# Altium schematic sheet P06_Boot.SchDoc
size A
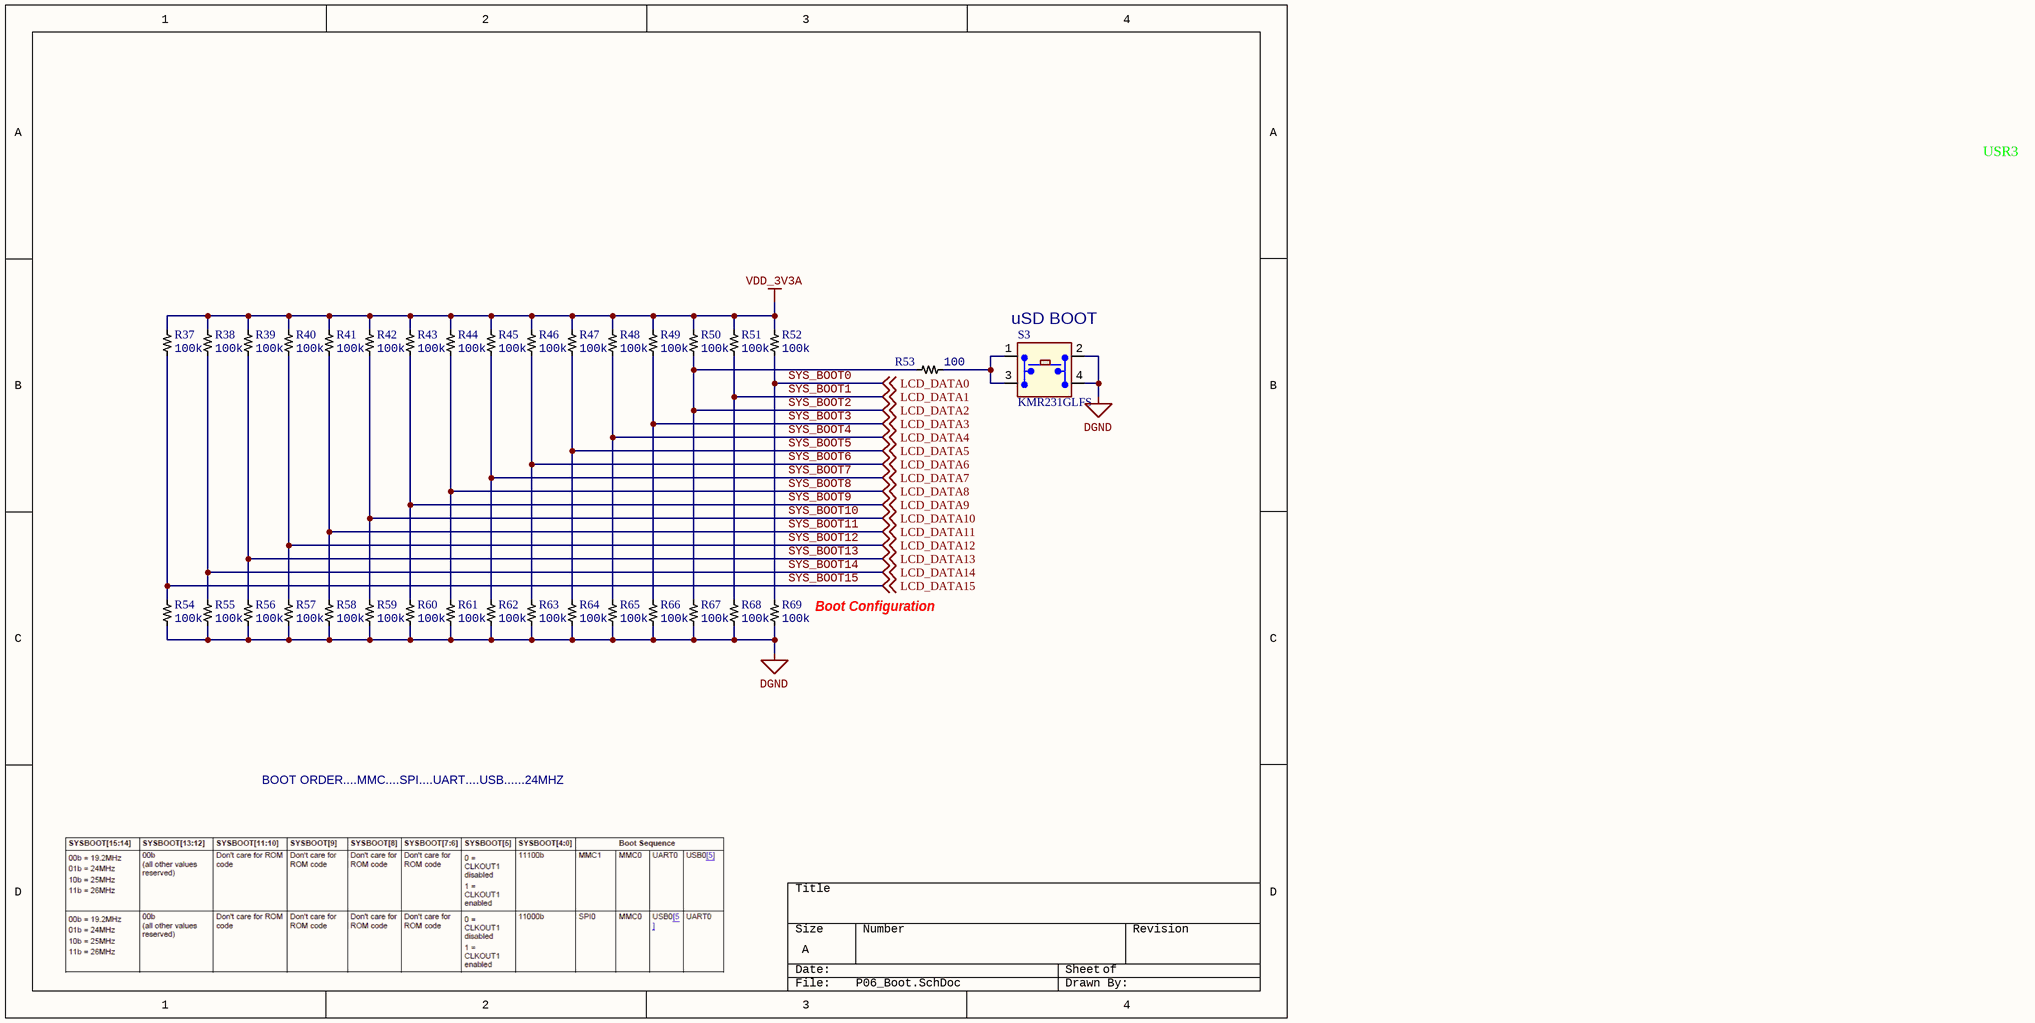
[diagram p0: P06_Boot.SchDoc]

## Parts
R37  Resistance: 100k  [RES0402]  (hidden comment: RC0402FR-07100KL)
R38  Resistance: 100k  [RES0402]  (hidden comment: RC0402FR-07100KL)
R39  Resistance: 100k  [RES0402]  (hidden comment: RC0402FR-07100KL)
R40  Resistance: 100k  [RES0402]  (hidden comment: RC0402FR-07100KL)
R41  Resistance: 100k  [RES0402]  (hidden comment: RC0402FR-07100KL)
R42  Resistance: 100k  [RES0402]  (hidden comment: RC0402FR-07100KL)
R43  Resistance: 100k  [RES0402]  (hidden comment: RC0402FR-07100KL)
R44  Resistance: 100k  [RES0402]  (hidden comment: RC0402FR-07100KL)
R45  Resistance: 100k  [RES0402]  (hidden comment: RC0402FR-07100KL)
R46  Resistance: 100k  [RES0402]  (hidden comment: RC0402FR-07100KL)
R47  Resistance: 100k  [RES0402]  (hidden comment: RC0402FR-07100KL)
R48  Resistance: 100k  [RES0402]  (hidden comment: RC0402FR-07100KL)
R49  Resistance: 100k  [RES0402]  (hidden comment: RC0402FR-07100KL)
R50  Resistance: 100k  [RES0402]  (hidden comment: RC0402FR-07100KL)
R51  Resistance: 100k  [RES0402]  (hidden comment: RC0402FR-07100KL)
R52  Resistance: 100k  [RES0402]  (hidden comment: RC0402FR-07100KL)
R53  Resistance: 100  [RES0402]  (hidden comment: RC0402FR-07100RL)
R54  Resistance: 100k  [RES0402]  (hidden comment: RC0402FR-07100KL)
R55  Resistance: 100k  [RES0402]  (hidden comment: RC0402FR-07100KL)
R56  Resistance: 100k  [RES0402]  (hidden comment: RC0402FR-07100KL)
R57  Resistance: 100k  [RES0402]  (hidden comment: RC0402FR-07100KL)
R58  Resistance: 100k  [RES0402]  (hidden comment: RC0402FR-07100KL)
R59  Resistance: 100k  [RES0402]  (hidden comment: RC0402FR-07100KL)
R60  Resistance: 100k  [RES0402]  (hidden comment: RC0402FR-07100KL)
R61  Resistance: 100k  [RES0402]  (hidden comment: RC0402FR-07100KL)
R62  Resistance: 100k  [RES0402]  (hidden comment: RC0402FR-07100KL)
R63  Resistance: 100k  [RES0402]  (hidden comment: RC0402FR-07100KL)
R64  Resistance: 100k  [RES0402]  (hidden comment: RC0402FR-07100KL)
R65  Resistance: 100k  [RES0402]  (hidden comment: RC0402FR-07100KL)
R66  Resistance: 100k  [RES0402]  (hidden comment: RC0402FR-07100KL)
R67  Resistance: 100k  [RES0402]  (hidden comment: RC0402FR-07100KL)
R68  Resistance: 100k  [RES0402]  (hidden comment: RC0402FR-07100KL)
R69  Resistance: 100k  [RES0402]  (hidden comment: RC0402FR-07100KL)
S3  KMR231GLFS  [SW4SMD_63X161LS]

## Nets
DGND: R54.1 R55.1 R56.1 R57.1 R58.1 R59.1 R60.1 R61.1 R62.1 R63.1 R64.1 R65.1 R66.1 R67.1 R68.1 R69.1 S3.2(A2) S3.4
VDD_3V3A: R37.2 R38.2 R39.2 R40.2 R41.2 R42.2 R43.2 R44.2 R45.2 R46.2 R47.2 R48.2 R49.2 R50.2 R51.2 R52.2
SYS_BOOT0: R52.1 R69.2 ; off-sheet LCD_DATA0  [also labelled LCD_DATA0]
SYS_BOOT1: R51.1 R68.2 ; off-sheet LCD_DATA1  [also labelled LCD_DATA1]
SYS_BOOT2: R50.1 R53.1 R67.2 ; off-sheet LCD_DATA2  [also labelled LCD_DATA2]
SYS_BOOT3: R49.1 R66.2 ; off-sheet LCD_DATA3  [also labelled LCD_DATA3]
SYS_BOOT4: R48.1 R65.2 ; off-sheet LCD_DATA4  [also labelled LCD_DATA4]
SYS_BOOT5: R47.1 R64.2 ; off-sheet LCD_DATA5  [also labelled LCD_DATA5]
SYS_BOOT6: R46.1 R63.2 ; off-sheet LCD_DATA6  [also labelled LCD_DATA6]
SYS_BOOT7: R45.1 R62.2 ; off-sheet LCD_DATA7  [also labelled LCD_DATA7]
SYS_BOOT8: R44.1 R61.2 ; off-sheet LCD_DATA8  [also labelled LCD_DATA8]
SYS_BOOT9: R43.1 R60.2 ; off-sheet LCD_DATA9  [also labelled LCD_DATA9]
SYS_BOOT10: R42.1 R59.2 ; off-sheet LCD_DATA10  [also labelled LCD_DATA10]
SYS_BOOT11: R41.1 R58.2 ; off-sheet LCD_DATA11  [also labelled LCD_DATA11]
SYS_BOOT12: R40.1 R57.2 ; off-sheet LCD_DATA12  [also labelled LCD_DATA12]
SYS_BOOT13: R39.1 R56.2 ; off-sheet LCD_DATA13  [also labelled LCD_DATA13]
SYS_BOOT14: R38.1 R55.2 ; off-sheet LCD_DATA14  [also labelled LCD_DATA14]
SYS_BOOT15: R37.1 R54.2 ; off-sheet LCD_DATA15  [also labelled LCD_DATA15]
NetR53_2: R53.2 S3.1(A1) S3.3(A3)

## Notes on the sheet
- USR3
- (near S3) uSD BOOT
- (near R69) Boot Configuration
- BOOT ORDER....MMC....SPI....UART....USB......24MHZ

## Library data of the parts
R37-R52 R54-R69 = RES_100k: Resistor 100kOhm 0402 SMD; Manufacturer: Yageo; Temperature Coefficient: 100ppm/°C; Tolerance: 1%; Power Rating: 63mW; Voltage Rating: 50V; Composition: Thick Film; Features: Moisture Resistant; Height: 0.016inch; Manufacturer Part Number: RC0402FR-07100KL; Number of Terminations: 2; Packaging: Tape and Reel; RoHS: Yes; Supplier 1: Mouser; Supplier Part Number 1: 603-RC0402FR-07100KL; Case/Package: 0402; Case Code (Metric): 1005; Case Code (Imperial): 0402; Min Operating Temperature: -55°C; Max Operating Temperature: 155°C; Package Quantity: 1; Termination: SMD/SMT; Military Standard: Not; Max Power Dissipation: 63mW; Working Voltage: 50V; Length: 0.039inch; Width: 0.02inch; Depth: 0.5mm; REACH SVHC: No SVHC; Lead Free: Lead Free; ComponentLink2Description: Datasheet; ComponentLink2URL: https://www.yageo.com/upload/media/product/productsearch/datasheet/rchip/PYu-RC_Group_51_RoHS_L_10.pdf; Supplier 2: Digi-Key; Supplier Part Number 2: 311-100KLRCT-ND
R53 = RES_100: Resistor 100Ohm 0402 SMD; Manufacturer: Yageo; Temperature Coefficient: 100ppm/°C; Tolerance: 1%; Power Rating: 62.5mW; Voltage Rating: 50V; ComponentLink1Description: https://datasheet.ciiva.com/7849/1784430-7849810.pdf?src-supplier=Element14; ComponentLink1URL: https://datasheet.ciiva.com/7849/1784430-7849810.pdf?src-supplier=Element14; Composition: Thick Film; Height: 0.32mm; Manufacturer Part Number: RC0402FR-07100RL; Packaging: Tape and Reel; Pricing 1: 1=0.10000, 10=0.01600, 100=0.00640, 1000=0.00289, 2500=0.00251, 5000=0.00207 (USD); RoHS: Yes; Stock 1: 45000776; Supplier 1: Digi-Key; Case/Package: 0402; Number of Pins: 2; Case Code (Imperial): 0402; Case Code (Metric): 1005; Min Operating Temperature: -55°C; Max Operating Temperature: 155°C; Military Standard: Not; Voltage Rating (DC): 50V; Termination: SMD/SMT; Length: 1mm; Width: 0.5mm; Depth: 0.5mm; REACH SVHC: No SVHC; Lead Free: Lead Free; ComponentLink2URL: https://datasheet.ciiva.com/11808/0900766b80c66297-11808765.pdf?src-supplier=RSComponents; ComponentLink2Description: https://datasheet.ciiva.com/11808/0900766b80c66297-11808765.pdf?src-supplier=RSComponents; ComponentLink3URL: https://datasheet.ciiva.com/12667/pyu-rc0402-51-rohs-l-6-r-12667957.pdf?src-supplier=Mouser; ComponentLink3Description: https://datasheet.ciiva.com/12667/pyu-rc0402-51-rohs-l-6-r-12667957.pdf?src-supplier=Mouser; ComponentLink4URL: https://datasheet.ciiva.com/22747/1018594-22747511.pdf?src-supplier=Element14; ComponentLink4Description: https://datasheet.ciiva.com/22747/1018594-22747511.pdf?src-supplier=Element14; ComponentLink5URL: https://datasheet.ciiva.com/28367/1018594-28367226.pdf?src-supplier=Element14; ComponentLink5Description: https://datasheet.ciiva.com/28367/1018594-28367226.pdf?src-supplier=Element14; ComponentLink6URL: https://datasheet.ciiva.com/16740/pyu-rc0402-51-rohs-l-6-r-16740566.pdf?src-supplier=Future+Electronics; ComponentLink6Description: https://datasheet.ciiva.com/16740/pyu-rc0402-51-rohs-l-6-r-16740566.pdf?src-supplier=Future+Electronics; ComponentLink7URL: https://datasheet.ciiva.com/15189/getdatasheetpartid-329466-15189335.pdf?src-supplier=Verical; ComponentLink7Description: https://datasheet.ciiva.com/15189/getdatasheetpartid-329466-15189335.pdf?src-supplier=Verical
S3 = KMR2: Microminiature Tact Switch for SMT; Manufacturer: C&K Components; Circuit: SPST-NO; Switch Function: Off-Mom; Contact Rating @ Voltage: 0.05A @ 32VDC; Actuator Type: Standard; Actuator Height off PCB, from Pins: 1.90mm; Actuator Orientation: Top Actuated; Outline: 4.60mm x 2.80mm; Illumination: Non-Illuminated; Operating Force: 300gf; Switch Travel: 0.25mm; Mechanical Life: 150,000 Cycles; Supplier 1: Digi-Key; Supplier Part Number 1: 401-1429-6-ND; Manufacturer Part Number: KMR231GLFS; RoHS: RoHS Compliant; Category: Switches; Stock 1: 32289; Pricing 1: 1=0.44, 10=0.416, 25=0.3744, 50=0.3326, 100=0.3188, 250=0.29108, 500=0.2772, 1000=0.22869 (USD); Mounting Type: Surface Mount; Termination Style: Gull Wing; Illumination Voltage (Nominal): -; Illumination Type, Color: -; Ingress Protection: -; Features: Grounding Pin; Packaging: Digi-Reel®; Actuator Material: -; Operating Temperature: -40°C ~ 85°C; ComponentLink1URL: http://www.ck-components.com/index.php?module=media&action=Display&cmpref=14414&lang=en&width=&height=&format=&alt=; ComponentLink1Description: http://www.ck-components.com/index.php?module=media&action=Display&cmpref=14414&lang=en&width=&height=&format=&alt=